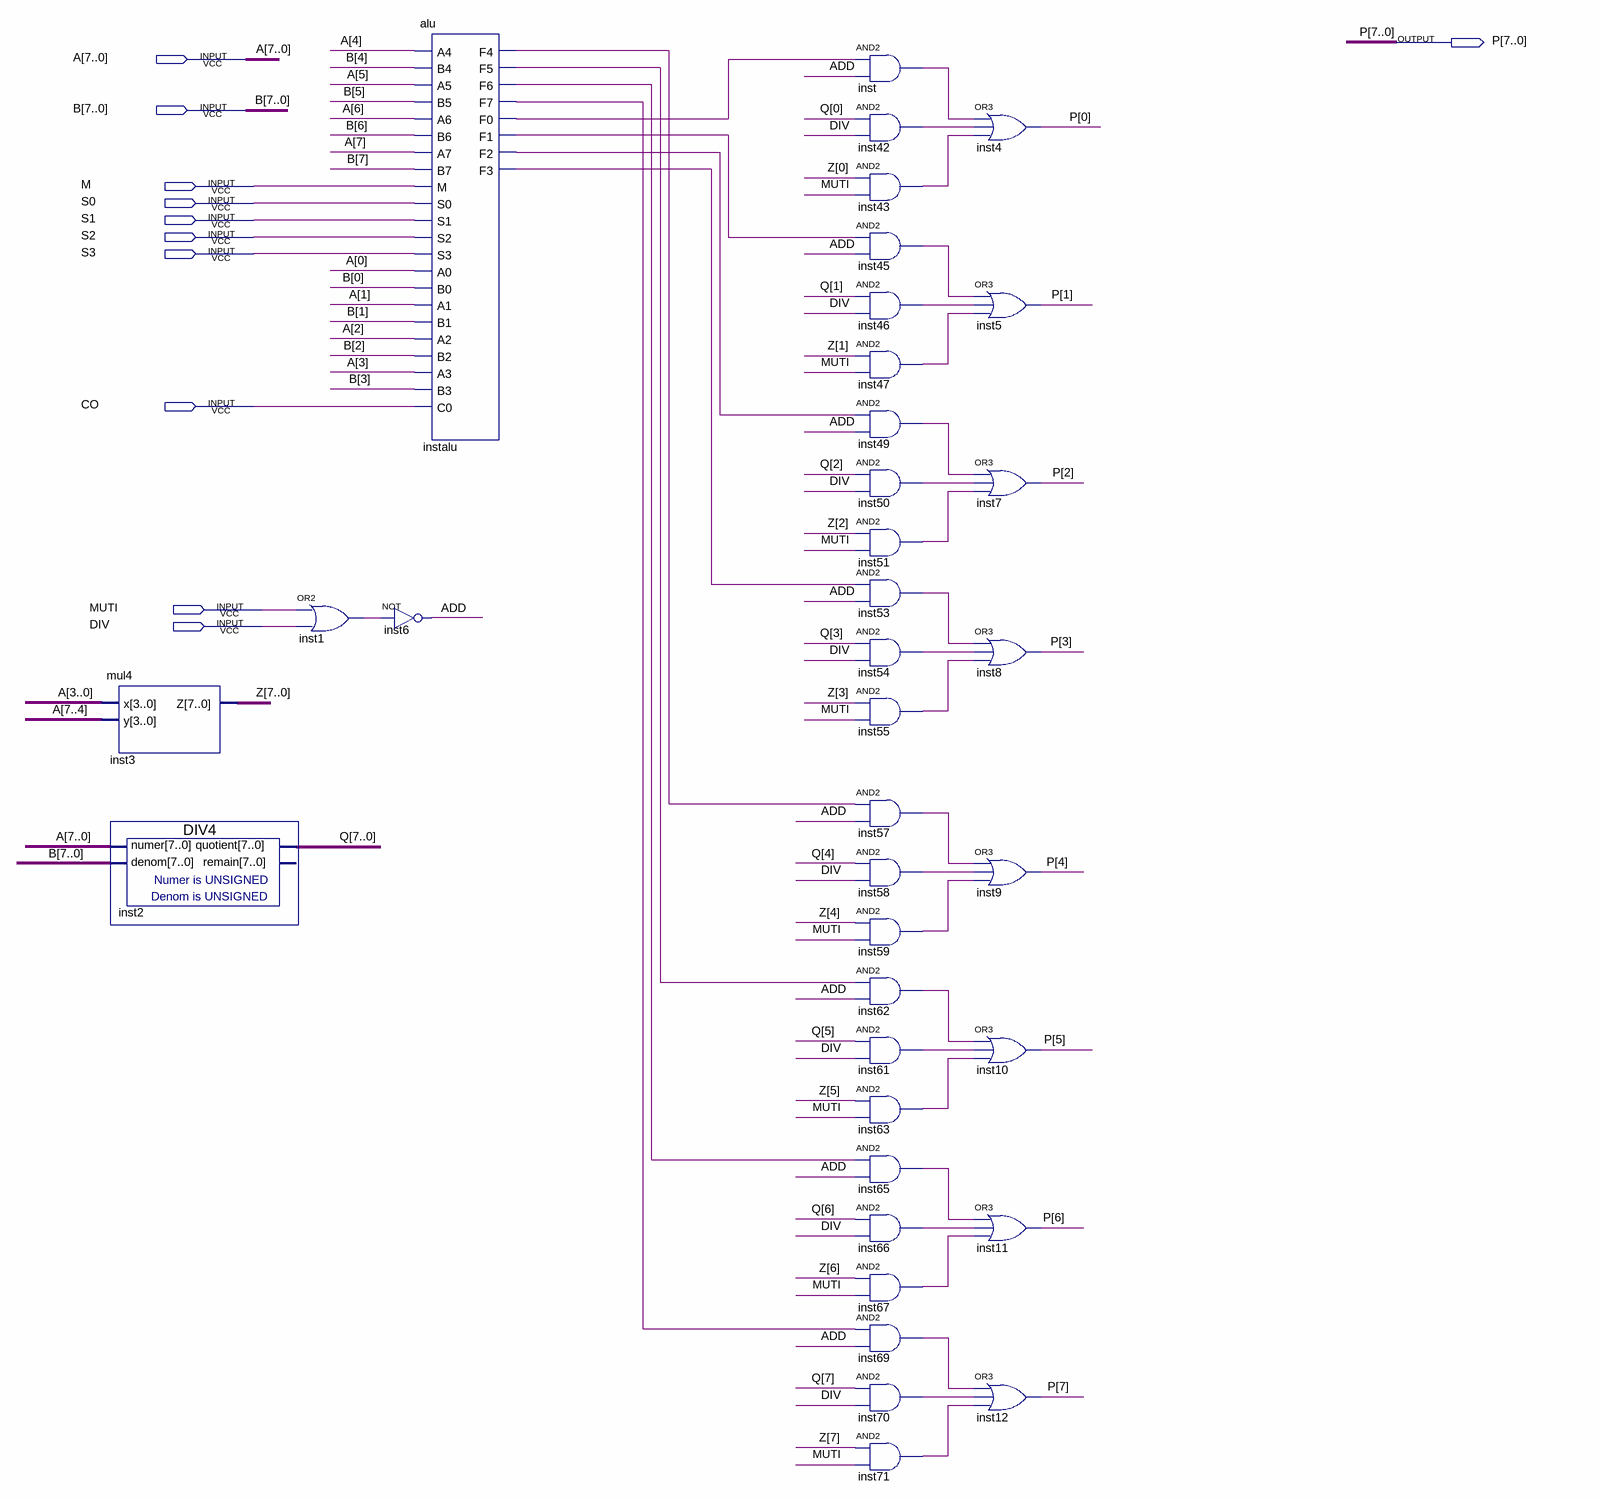
[diagram p0: schematic sheet]
// Quartus schematic ALUint.bdf as structural Verilog: 37 symbols, 11 pins
module ALUint (
  input  [7:0] A,
  input  [7:0] B,
  input  M,
  input  S0,
  input  S1,
  input  S2,
  input  S3,
  input  CO,
  input  MUTI,
  input  DIV,
  output [7:0] P
);

  wire ADD, inst1_out, inst42_out, inst43_out, inst45_out, inst46_out, inst47_out, inst49_out, inst50_out,
       inst51_out, inst53_out, inst54_out, inst55_out, inst57_out, inst58_out, inst59_out, inst61_out,
       inst62_out, inst63_out, inst65_out, inst66_out, inst67_out, inst69_out, inst70_out, inst71_out,
       inst_out, instalu_f0, instalu_f1, instalu_f2, instalu_f3, instalu_f4, instalu_f5, instalu_f6,
       instalu_f7;
  wire [7:0] Q, Z;

  mul4 inst3 (.x(A[3:0]), .y(A[7:4]), .Z(Z));
  DIV4 inst2 (.numer(A), .denom(B), .quotient(Q));  // open: remain
  or inst1 (inst1_out, MUTI, DIV);
  alu instalu (
    .A4(A[4]), .B4(B[4]), .A5(A[5]), .B5(B[5]), .A6(A[6]), .B6(B[6]), .A7(A[7]), .B7(B[7]), .M(M), .S0(S0),
    .S1(S1), .S2(S2), .S3(S3), .A0(A[0]), .B0(B[0]), .A1(A[1]), .B1(B[1]), .A2(A[2]), .B2(B[2]), .A3(A[3]),
    .B3(B[3]), .C0(CO), .F4(instalu_f4), .F5(instalu_f5), .F6(instalu_f6), .F7(instalu_f7), .F0(instalu_f0),
    .F1(instalu_f1), .F2(instalu_f2), .F3(instalu_f3));
  not inst6 (ADD, inst1_out);
  and inst (inst_out, instalu_f0, ADD);
  and inst42 (inst42_out, Q[0], DIV);
  and inst43 (inst43_out, Z[0], MUTI);
  and inst45 (inst45_out, instalu_f1, ADD);
  and inst46 (inst46_out, Q[1], DIV);
  and inst47 (inst47_out, Z[1], MUTI);
  and inst49 (inst49_out, instalu_f2, ADD);
  and inst50 (inst50_out, Q[2], DIV);
  and inst51 (inst51_out, Z[2], MUTI);
  and inst53 (inst53_out, instalu_f3, ADD);
  and inst54 (inst54_out, Q[3], DIV);
  and inst55 (inst55_out, Z[3], MUTI);
  and inst57 (inst57_out, instalu_f4, ADD);
  and inst58 (inst58_out, Q[4], DIV);
  and inst59 (inst59_out, Z[4], MUTI);
  and inst62 (inst62_out, instalu_f5, ADD);
  and inst61 (inst61_out, Q[5], DIV);
  and inst63 (inst63_out, Z[5], MUTI);
  and inst65 (inst65_out, instalu_f6, ADD);
  and inst66 (inst66_out, Q[6], DIV);
  and inst67 (inst67_out, Z[6], MUTI);
  and inst69 (inst69_out, instalu_f7, ADD);
  and inst70 (inst70_out, Q[7], DIV);
  and inst71 (inst71_out, Z[7], MUTI);
  or inst4 (P[0], inst_out, inst42_out, inst43_out);
  or inst5 (P[1], inst45_out, inst46_out, inst47_out);
  or inst7 (P[2], inst49_out, inst50_out, inst51_out);
  or inst8 (P[3], inst53_out, inst54_out, inst55_out);
  or inst9 (P[4], inst57_out, inst58_out, inst59_out);
  or inst10 (P[5], inst62_out, inst61_out, inst63_out);
  or inst11 (P[6], inst65_out, inst66_out, inst67_out);
  or inst12 (P[7], inst69_out, inst70_out, inst71_out);
endmodule
